# Altium schematic sheet mcu.SchDoc
size A; SheetNumber: 1; SheetTotal: 3
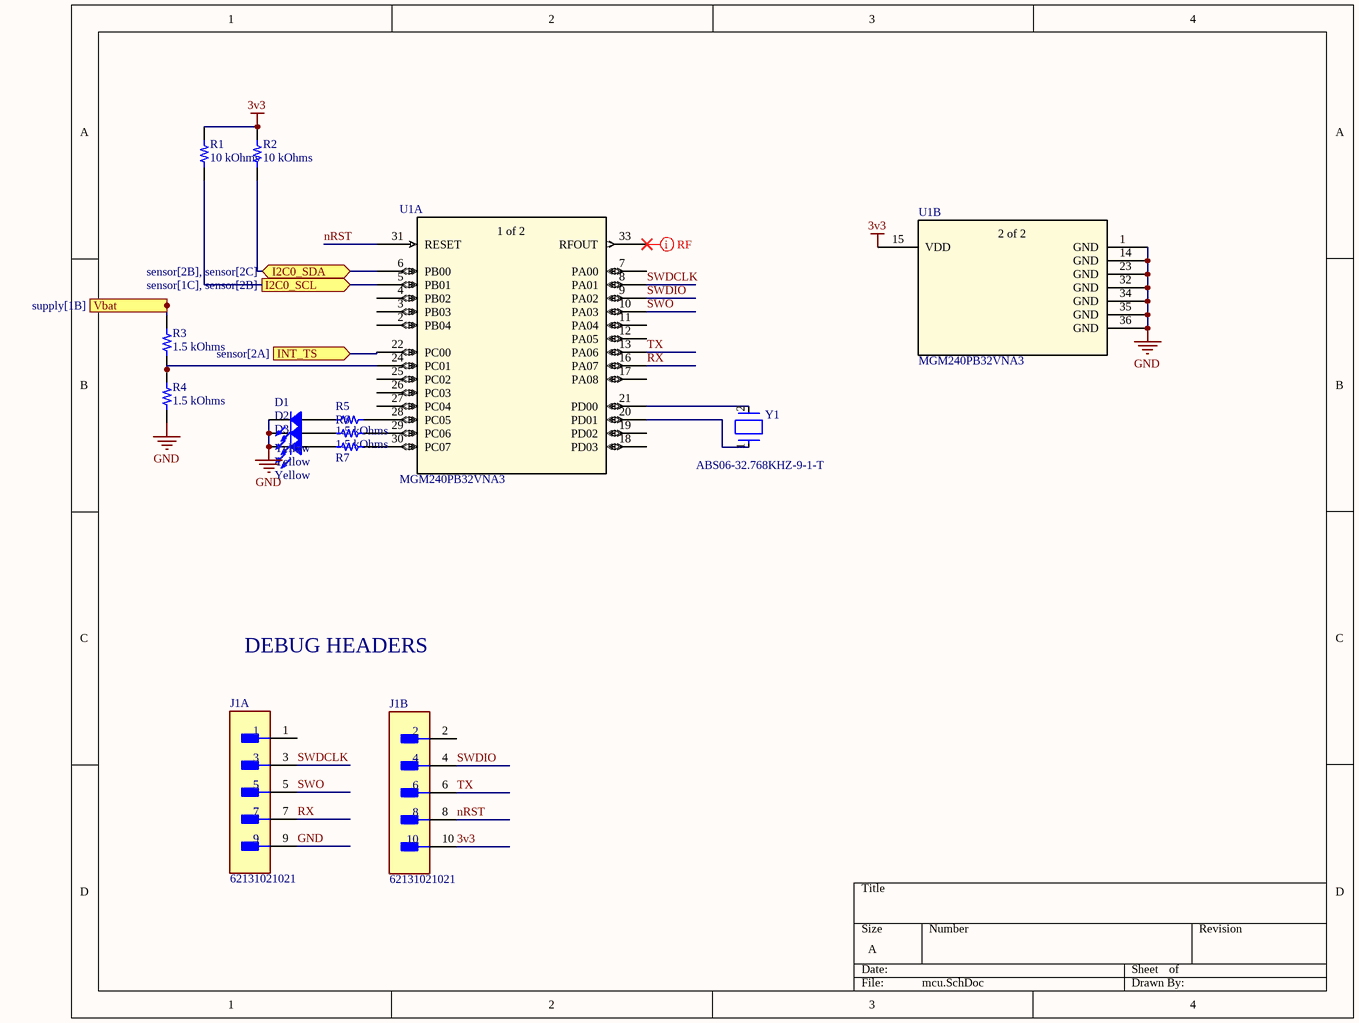
[diagram p0: mcu.SchDoc]

## Parts
D1  Yellow  [LED 0402_1005 YELLOW]
D2  Yellow  [LED 0402_1005 YELLOW]
D3  Yellow  [LED 0402_1005 YELLOW]
J1  62131021021  [FP-62131021021-MFG]  (parts A,B of 2)
R1  10 kOhms  [RES 0402_1005]
R2  10 kOhms  [RES 0402_1005]
R3  1.5 kOhms  [RES 0402_1005]
R4  1.5 kOhms  [RES 0402_1005]
R5  1.5 kOhms  [RES 0402_1005]
R6  1.5 kOhms  [RES 0402_1005]
R7  (no value)  [RES 0402_1005]
U1  MGM240PB32VNA3  [xGM240P]  (parts A,B of 2)
Y1  ABS06-32.768KHZ-9-1-T  [FP-ABS06-MFG]

## Ports
I2C0_SCL (out, see sensor[1C], sensor[2B]), I2C0_SDA (bidir, see sensor[2B], sensor[2C]), INT_TS (in, see sensor[2A]), Vbat (see supply[1B])

## Nets
3v3: J1.10 R1.1 R2.1 U1.15(VDD)
GND: D1.2 D2.2 D3.2 J1.9 R4.2 U1.1(GND) U1.14(GND) U1.23(GND) U1.32(GND) U1.34(GND) U1.35(GND) U1.36(GND)
I2C0_SCL: R1.2 U1.5(PB01) ; port I2C0_SCL
I2C0_SDA: R2.2 U1.6(PB00) ; port I2C0_SDA
INT_TS: U1.22(PC00) ; port INT_TS
nRST: J1.8 U1.31(RESET)
RX: J1.7 U1.16(PA07)
SWDCLK: J1.3 U1.8(PA01)
SWDIO: J1.4 U1.9(PA02)
SWO: J1.5 U1.10(PA03)
TX: J1.6 U1.13(PA06)
Vbat: R3.1 ; port Vbat
NetD1_1: D1.1 R5.1
NetD2_1: D2.1 R6.1
NetD3_1: D3.1 R7.1
NetR3_2: R3.2 R4.1 U1.24(PC01)
NetR5_2: R5.2 U1.28(PC05)
NetR6_2: R6.2 U1.29(PC06)
NetR7_2: R7.2 U1.30(PC07)
NetU1_20: U1.20(PD01) Y1.1
NetU1_21: U1.21(PD00) Y1.2

Not connected (* = marked no-connect by the designer): J1 1 2; U1 2(PB04) 3(PB03) 4(PB02) 7(PA00) 11(PA04) 12(PA05) 17(PA08) 18(PD03) 19(PD02) 25(PC02) 26(PC03) 27(PC04) 33(RFOUT)*

## Layout directives
mark named RF: NetU1_33

## Notes on the sheet
- DEBUG HEADERS
- (in symbol MGM240PB32VNA3, part A) 1 of 2
- (in symbol MGM240PB32VNA3, part B) 2 of 2

## Library data of the parts
D1-D3 = BL-HKC37A-AV-TRB: 0402 YELLOW; Manufacturer: American Bright Optoelectronics Corporation; Configuration: Standard; Current - Test: 20mA; Lens Color: Colorless; Lens Style: Rectangle with Flat Top; Lens Transparency: Clear; Millicandela Rating: 120mcd; Viewing Angle: 120°; Voltage - Forward (Vf) (Typ): 2.2V; Wavelength - Dominant: 589nm; Wavelength - Peak: 590nm; Part Number: BL-HKC37A-AV-TRB; Color: Yellow; ComponentLink1Description: Datasheet; ComponentLink1URL: https://americanbrightled.com/pdffiles/smt/BL-HKC37A-AV-TRB.pdf; ComponentLink2Description: DigiKey Link; ComponentLink2URL: https://www.digikey.com/en/products/detail/american-bright-optoelectronics-corporation/BL-HKC37A-AV-TRB/9678171; Device Package: 0402 (1005 Metric); Height (Max): 0.45mm; LastUpdated: 11/9/2022 10:29:51 am; Lifecycle Status: Active; Minimum Order: 1; Mounting Type: Surface Mount; Package / Case: 0402 (1005 Metric); Packaging: TapeAndReel; PartId: 1041; Part Status: Active; Price: 0.06; Series: -; Size / Dimension: 1.00mm L x 0.50mm W; Supplier 1: DigiKey; Supplier Part Number 1: BL-HKC37A-AV-TRBCT-ND; Supplier Device Package: 0402; Value: Yellow
J1 = CMP-1502-00938-2: 1.27mm SMT Straight Dual Pin Header WR-PHD; RoHS Compliant: Yes
R1 R2 R7 = ERA-2VRW1501X: RES 1.5K OHM 0.05% 1/10W 0402; Manufacturer: Panasonic Electronic Components; Power (Watts): 0.1W, 1/10W; Resistance: 1.5 kOhms; Temperature Coefficient: ±10ppm/°C; Part Number: ERA-2VRW1501X; ComponentLink1Description: Datasheet; ComponentLink1URL: https://api.pim.na.industrial.panasonic.com/file_stream/main/fileversion/9152; ComponentLink2Description: DigiKey Link; ComponentLink2URL: https://www.digikey.com/en/products/detail/panasonic-electronic-components/ERA-2VRW1501X/12086957; Composition: Thin Film; Device Package: 0402 (1005 Metric); Features: Anti-Sulfur, Automotive AEC-Q200; Height - Seated (Max): 0.016" (0.40mm); LastUpdated: 11/9/2022 9:53:08 am; Lifecycle Status: Active; Minimum Order: 1; Number of Terminations: 2; Operating Temperature: -55°C ~ 155°C; Package / Case: 0402 (1005 Metric); Packaging: TapeAndReel; PartId: 67400; Part Status: Active; Price: 0.24; Ratings: AEC-Q200; Series: ERA-2V; Size / Dimension: 0.039" L x 0.020" W (1.00mm x 0.50mm); Supplier 1: DigiKey; Supplier Part Number 1: 10-ERA-2VRW1501XCT-ND; Supplier Device Package: 0402; Tolerance: ±0.05%
  R1 R2: Value: 10 kOhms
R3-R6 = ERA-2VRW1501X: RES 1.5K OHM 0.05% 1/10W 0402; Manufacturer: Panasonic Electronic Components; Power (Watts): 0.1W, 1/10W; Temperature Coefficient: ±10ppm/°C; Part Number: ERA-2VRW1501X; Value: 1.5 kOhms; ComponentLink1Description: Datasheet; ComponentLink1URL: https://api.pim.na.industrial.panasonic.com/file_stream/main/fileversion/9152; ComponentLink2Description: DigiKey Link; ComponentLink2URL: https://www.digikey.com/en/products/detail/panasonic-electronic-components/ERA-2VRW1501X/12086957; Composition: Thin Film; Device Package: 0402 (1005 Metric); Features: Anti-Sulfur, Automotive AEC-Q200; Height - Seated (Max): 0.016" (0.40mm); LastUpdated: 11/9/2022 9:53:08 am; Lifecycle Status: Active; Minimum Order: 1; Number of Terminations: 2; Operating Temperature: -55°C ~ 155°C; Package / Case: 0402 (1005 Metric); Packaging: TapeAndReel; PartId: 67400; Part Status: Active; Price: 0.24; Ratings: AEC-Q200; Resistance: 1.5 kOhms; Series: ERA-2V; Size / Dimension: 0.039" L x 0.020" W (1.00mm x 0.50mm); Supplier 1: DigiKey; Supplier Part Number 1: 10-ERA-2VRW1501XCT-ND; Supplier Device Package: 0402; Tolerance: ±0.05%
U1 = MGM240PB32VNA3: No Description Available; Mfr_Name: Silicon Labs; RefDes: RefDes; Type: Type
Y1 = CMP-27762-003430-2: Crystal 32.768kHz ±10ppm (Tol) 9pF FUND 90kΩ 2-Pin Mini-CSMD T/R; Series Resistance: 90kR; Series: ABS06; Case/Package: CSMD; Package Quantity: 3000; Load Capacitance: 9pF; Number of Pins: 2; Tolerance: 10ppm; RoHS Compliant: Yes; Depth: 1.2mm; Termination: SMD/SMT; Min Operating Temperature: -40°C; Length: 2mm; Packaging: Tape and Reel; Max Operating Temperature: 85°C; Frequency Tolerance: 10ppm; Width: 1.2mm; ESR (Equivalent Series Resistance): 90kR; Radiation Hardening: No; Frequency: 32.768kHz; REACH SVHC: No SVHC; Mount: Surface Mount; Height: 0.6mm